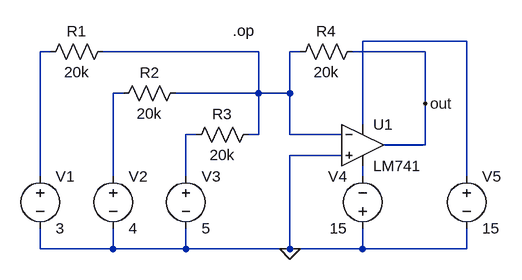
[diagram p0: schematic 8-sum.asc]
8-sum.asc, the LTspice schematic file:
Version 4.1
SHEET 1 880 680
WIRE 384 0 224 0
WIRE -256 16 -272 16
WIRE 64 16 -176 16
WIRE 128 16 112 16
WIRE 320 16 208 16
WIRE -144 80 -160 80
WIRE 64 80 64 16
WIRE 64 80 -64 80
WIRE 112 80 112 16
WIRE 112 80 64 80
WIRE 320 96 320 16
WIRE 224 128 224 0
WIRE -32 144 -48 144
WIRE 64 144 64 80
WIRE 64 144 48 144
WIRE 112 144 112 80
WIRE 192 144 112 144
WIRE 320 160 320 96
WIRE 320 160 256 160
WIRE 192 176 112 176
WIRE -272 208 -272 16
WIRE -160 208 -160 80
WIRE -48 208 -48 144
WIRE 224 208 224 192
WIRE 384 208 384 0
WIRE -272 320 -272 288
WIRE -160 320 -160 288
WIRE -160 320 -272 320
WIRE -48 320 -48 288
WIRE -48 320 -160 320
WIRE 112 320 112 176
WIRE 112 320 -48 320
WIRE 224 320 224 288
WIRE 224 320 112 320
WIRE 384 320 384 288
WIRE 384 320 224 320
FLAG 320 96 out
FLAG 112 320 0
SYMBOL LM741 224 96 R0
SYMATTR InstName U1
SYMBOL res 224 0 R90
WINDOW 0 0 56 VBottom 2
WINDOW 3 32 56 VTop 2
SYMATTR InstName R4
SYMATTR Value 20k
SYMBOL voltage 224 304 R180
WINDOW 0 24 96 Left 2
WINDOW 3 24 16 Left 2
SYMATTR InstName V4
SYMATTR Value 15
SYMBOL voltage 384 192 R0
SYMATTR InstName V5
SYMATTR Value 15
SYMBOL res 64 128 R90
WINDOW 0 0 56 VBottom 2
WINDOW 3 32 56 VTop 2
SYMATTR InstName R3
SYMATTR Value 20k
SYMBOL res -48 64 R90
WINDOW 0 0 56 VBottom 2
WINDOW 3 32 56 VTop 2
SYMATTR InstName R2
SYMATTR Value 20k
SYMBOL res -160 0 R90
WINDOW 0 0 56 VBottom 2
WINDOW 3 32 56 VTop 2
SYMATTR InstName R1
SYMATTR Value 20k
SYMBOL voltage -48 192 R0
SYMATTR InstName V3
SYMATTR Value 5
SYMBOL voltage -160 192 R0
SYMATTR InstName V2
SYMATTR Value 4
SYMBOL voltage -272 192 R0
SYMATTR InstName V1
SYMATTR Value 3
TEXT 24 -16 Left 2 !.op

The netlist it stands for:
* 8-sum.asc
X§U1 0 N003 N001 N006 out LM741  ; pins In+ In- V+ V- OUT
R4 out N003 20k
V4 0 N006 15
V5 N001 0 15
R3 N003 N005 20k
R2 N003 N004 20k
R1 N003 N002 20k
V3 N005 0 5
V2 N004 0 4
V1 N002 0 3
.op
.lib LM741.lib
.backanno
.end